# EAGLE design Teensy Board (EAGLE 8.6.0)
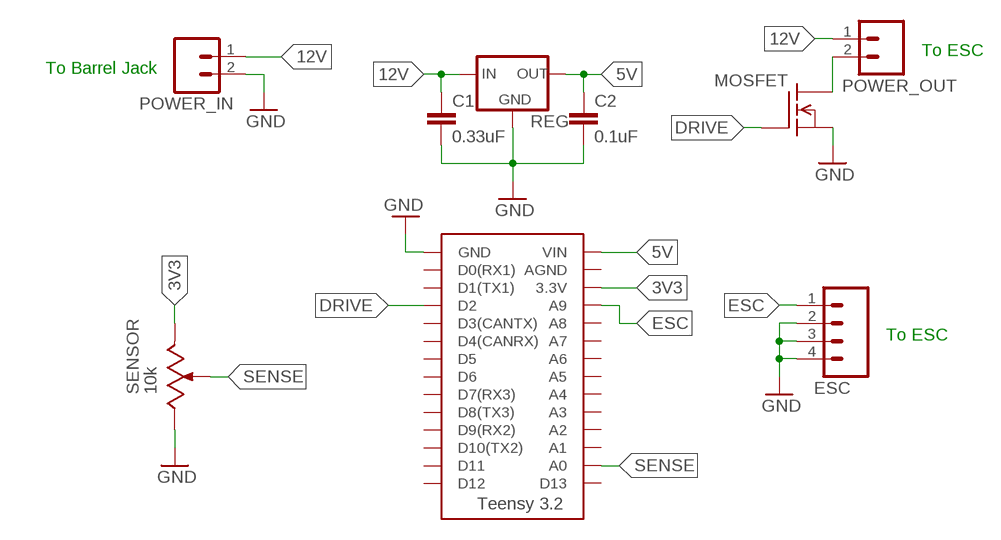
[diagram p0: schematic, sheet 1]

## Parts
C1  0.33uF  CAP0805  [0805]
C2  0.1uF  CAP0805  [0805]
ESC  M04  [1X04]
MOSFET  SI2312  [SOT-23]
POWER_IN  M02  [1X02]
POWER_OUT  M02  [1X02]
REG  L78L  [SOT-89]
SENSOR  10k  SV03  [SV03A]
U$2  TEENSY_3.2_SIMPLE  [TEENSY_3.2_SIMPLE]

## Nets
3V3: SENSOR.1(E) U$2.3.3V
5V: C2.1 REG.1(OUT) U$2.VIN
12V: C1.1 POWER_IN.1 POWER_OUT.1 REG.3(IN)
DRIVE: MOSFET.1(G) U$2.D2
ESC: ESC.1 U$2.A9
GND: C1.2 C2.2 ESC.2 ESC.3 ESC.4 MOSFET.2(S) POWER_IN.2 REG.2(GND) REG.2.1(GND) REG.2.2(GND) SENSOR.3(A) U$2.GND
N$3: MOSFET.3(D) POWER_OUT.2
SENSE: SENSOR.2(S) SENSOR.2.1(S) U$2.A0
Unconnected: U$2.A1 U$2.A2 U$2.A3 U$2.A4 U$2.A5 U$2.A6 U$2.A7 U$2.A8 U$2.AGND U$2.D0(RX1) U$2.D1(TX1) U$2.D3(CANTX) U$2.D4(CANRX) U$2.D5 U$2.D6 U$2.D7(RX3) U$2.D8(TX3) U$2.D9(RX2) U$2.D10(TX2) U$2.D11 U$2.D12 U$2.D13

## Notes on the sheet
- To ESC
- To Barrel Jack
- To ESC

## Library data of the parts
C1 C2 = Controls Library:CAP: Capacitor Standard 0603 ceramic capacitor, and 0.1" leaded capacitor.
ESC = Controls Library:M04: Standard 4-pin 0.1" header. NOTES ON THE VARIANTS LOCK and LOCK_LONGPADS... This footprint was designed to help hold the alignment of a through-hole component (i.e. 6-pin header) while soldering it into place. You may notice that each hole has been shifted either up or down by 0.005 of an inch from it's more standard position (which is a perfectly straight line). This slight alteration caused the pins (the squares in the middle) to touch the edges of the holes. Because they are alternating, it causes a "brace" to hold the component in place. 0.005 has proven to be the perfect amount of "off-center" position when using our standard breakaway headers. Although looks a little odd when you look at the bare footprint, once you have a header in there, the alteration is very hard to notice. Also,if you push a header all the way into place, it is covered up entirely on the bottom side. This idea of altering the position of holes to aid alignment will be further integrated into the Sparkfun Library for other footprints. It can help hold any component with 3 or more connection pins. Note: The Sparkfun version includes many other packages including surface mount that may be of future interest. Source: Sparkfun <https://github.com/sparkfun/SparkFun-Eagle-Libraries>
MOSFET = Controls Library:SI2312: Micro Commerical Components N-Channel MOSFET Vds: 20 V (MAX) Id: 5A (MAX) Vgs: 8 V (MAX) Rds(on): 0.0318 Ohms (Vgs=4.5V, ID=5.0A) Datasheet <http://www.mccsemi.com/up_pdf/SI2312(SOT-23).pdf>
POWER_IN POWER_OUT = Controls Library:M02: Standard 2-pin 0.1" header. NOTES ON THE VARIANTS LOCK and LOCK_LONGPADS... This footprint was designed to help hold the alignment of a through-hole component (i.e. 6-pin header) while soldering it into place. You may notice that each hole has been shifted either up or down by 0.005 of an inch from it's more standard position (which is a perfectly straight line). This slight alteration caused the pins (the squares in the middle) to touch the edges of the holes. Because they are alternating, it causes a "brace" to hold the component in place. 0.005 has proven to be the perfect amount of "off-center" position when using our standard breakaway headers. Although looks a little odd when you look at the bare footprint, once you have a header in there, the alteration is very hard to notice. Also,if you push a header all the way into place, it is covered up entirely on the bottom side. This idea of altering the position of holes to aid alignment will be further integrated into the Sparkfun Library for other footprints. It can help hold any component with 3 or more connection pins. Note: The Sparkfun version includes many other packages including surface mount that may be of future interest. Source: Sparkfun <https://github.com/sparkfun/SparkFun-Eagle-Libraries>
REG = Controls Library:L78L: STMicroelectronics Positive Voltage Regulator Vout: 3.3; 5; 6; 8; 9; 10; 12; 15; 18; 24V Iout: 100mA (MAX) Datasheet <http://www.st.com/content/ccc/resource/technical/document/datasheet/15/55/e5/aa/23/5b/43/fd/CD00000446.pdf/files/CD00000446.pdf/jcr:content/translations/en.CD00000446.pdf>
SENSOR = Controls Library:SV03: Murata SV03 Series Rotary Position Sensor Total Resistance: 10 kOhms +/-30% Linearity: +/-2% Effective Rotational Angle: 333.3° Rated Voltage: 5V Datasheet <https://www.murata.com/~/media/webrenewal/support/library/catalog/products/sensor/rotaryposition/r51e.ashx>
U$2 = Controls Library:TEENSY_3.2_SIMPLE: Simple version of the Teensy 3.2 board that only uses the 2 main rows of pins, not the inner pins or the pins opposite the usb port.

## Board
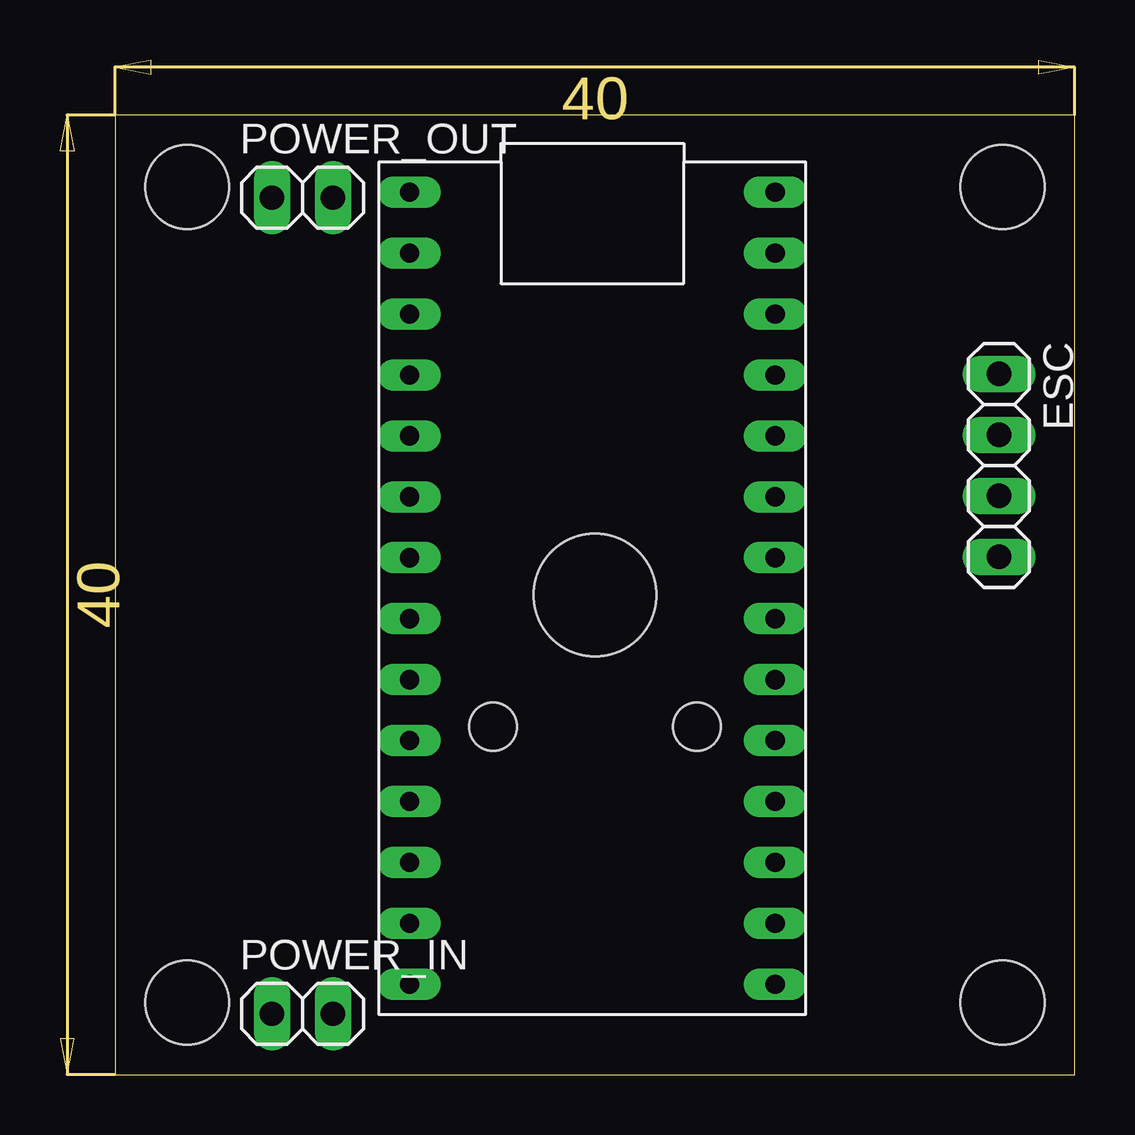
[diagram p1: board, top side]
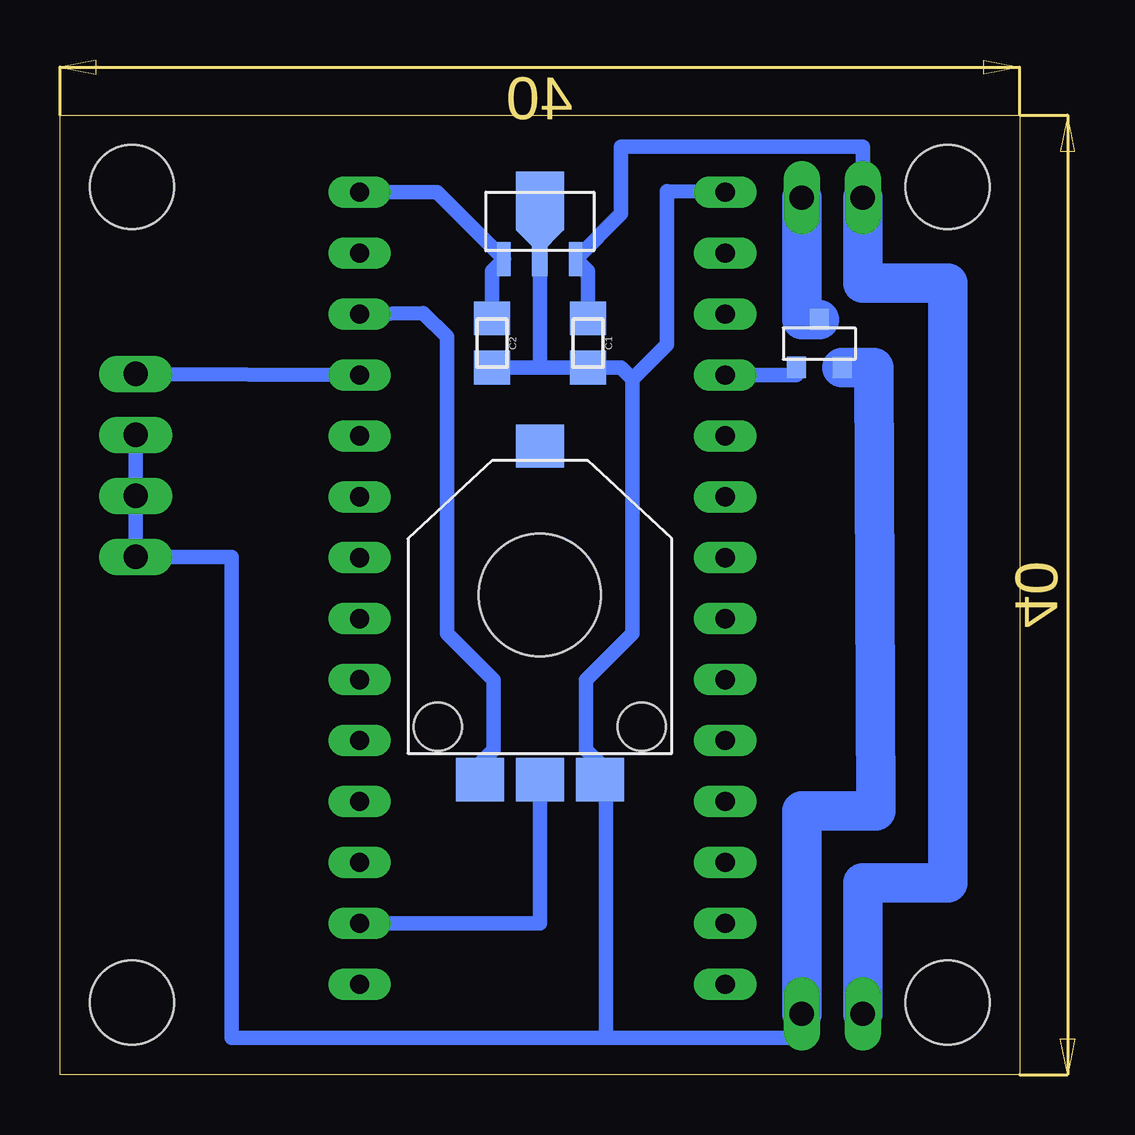
[diagram p2: board, bottom side, seen from below]

Size 40 x 40 mm. Coordinates in mm from the lower left corner, seen from the top.
Outline: 0,0 40,0 40,40 0,40 0,0
Copper layers (1*16): Top 0.035mm / dielectric 1.5mm / Bottom 0.035mm
Design rules "default": minimum track width 6mil, minimum drill 0.35mm, track to track 6mil, track to pad 6mil, pad to pad 6mil, via to via 6mil, smd to smd 6mil, copper to edge 40mil, drill to drill 6mil, minimum pad ring 10mil, minimum via ring 8mil, stop-mask expansion 4mil, vias tented up to drill 0mil, thermal gap 10mil
Holes 3.5 mm at 37,37 37,3 3,3 3,37

### Footprints (pad centres in the part's own frame; a part is rotated, then mirrored left to right if it is on the bottom)
0805 = smd 1.4 x 1.5: 1 -1.025,0; 2 1.025,0
1X04 = drill 1.016 long: 1 -3.81,0; 2 -1.27,0; 3 1.27,0; 4 3.81,0
SOT-23 = smd 0.8 x 0.9: 1 -0.95,-1; 2 0.95,-1; 3 0,1
1X02 = drill 1.016 long: 1 -1.27,0; 2 1.27,0
SOT-89 = smd 0.57 x 1.4: 1 -1.5,0; 3 1.5,0 | smd 0.65 x 1.4: 2 0,0 | smd 1.414 x 1.414 rotated 45: 2.1 0,1.2 | smd 2 x 2.45: 2.2 0,2.425
SV03A = smd 2 x 1.8: 1 -2.5,-7.7; 2 0,-7.7; 2.1 0,6.2; 3 2.5,-7.7 | hole 5.1: 0,0 | hole 2: -4.25,-5.5; 4.25,-5.5
TEENSY_3.2_SIMPLE = drill 0.8 long: 3.3V 16.51,29.21; A0 16.51,3.81; A1 16.51,6.35; A2 16.51,8.89; A3 16.51,11.43; A4 16.51,13.97; A5 16.51,16.51; A6 16.51,19.05; A7 16.51,21.59; A8 16.51,24.13; A9 16.51,26.67; AGND 16.51,31.75; D0(RX1) 1.27,31.75; D1(TX1) 1.27,29.21; D2 1.27,26.67; D3(CANTX) 1.27,24.13; D4(CANRX) 1.27,21.59; D5 1.27,19.05; D6 1.27,16.51; D7(RX3) 1.27,13.97; D8(TX3) 1.27,11.43; D9(RX2) 1.27,8.89; D10(TX2) 1.27,6.35; D11 1.27,3.81; D12 1.27,1.27; D13 16.51,1.27; GND 1.27,34.29; VIN 16.51,34.29

### Placement (x,y rotation side)
C1  18,30.5 270 bottom
C2  22,30.5 270 bottom
ESC  36.84,25.4 270 top
MOSFET  8.35,30.48 0 bottom
POWER_IN  7.81,2.54 0 top
POWER_OUT  7.81,36.56 0 top
REG  20,34 0 bottom
SENSOR  20,20 0 bottom
U$2  11,2.5 0 top

### Tracks (layer width: path | path; a pad name or v marks a point on that pad's centre or on a via)
3V3
  Bottom 0.61: U$2.3.3V 24.86,31.75 23.87,30.76 23.87,18.4 21.93,16.45 21.93,13.54 22.5,12.97 SENSOR.1
5V
  Bottom 0.61: C2.1 22,33.5 REG.1 24.29,36.79 U$2.VIN
12V
  Bottom 0.61: C1.1 18,33.5 REG.3 16.61,35.9 16.61,38.68 6.54,38.68 POWER_OUT.1
  Bottom 1.651: POWER_OUT.1 6.54,33 3,33 3,8 6.54,8 POWER_IN.1
DRIVE
  Bottom 0.61: U$2.D2 9.3,29.17 MOSFET.1
ESC
  Bottom 0.61: U$2.A9 ESC.1
GND
  Bottom 0.61: U$2.GND 14.7,36.83 14.7,30.43 16.13,29 | 19.66,36.83 REG.2.2 | ESC.2 ESC.3 ESC.4 32.84,21.59 32.84,1.54 17.24,1.54 | 16.13,29 16.13,18.4 18.07,16.45 18.07,13.54 17.5,12.97 SENSOR.3 17.24,12.58 17.24,1.54 | 20,29.48 C1.2 16.6,29.48 16.13,29 | 20,29.48 C2.2 | REG.2 20,29.48 | 17.24,1.54 9.08,1.54 POWER_IN.2
  Bottom 1.651: POWER_IN.2 9.08,11 6,11 6.08,29.48 MOSFET.2
N$3
  Bottom 1.651: POWER_OUT.2 9.08,31.48 MOSFET.3
SENSE
  Bottom 0.61: U$2.A0 20,6.31 SENSOR.2